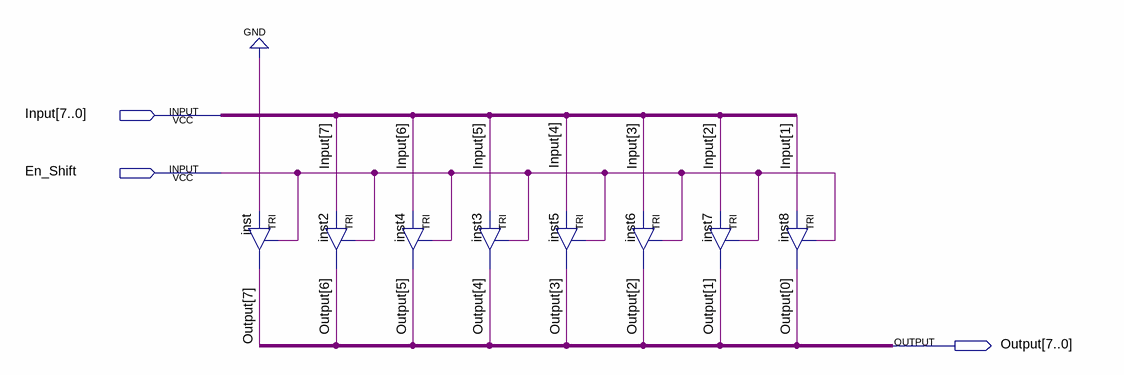
[diagram p0: schematic sheet]
// Quartus schematic Shift_1.bdf as structural Verilog: 8 symbols, 3 pins
module Shift_1 (
  input  [7:0] Input,
  input  En_Shift,
  output [7:0] Output
);

  TRI inst (.IN(1'b0), .OE(En_Shift), .OUT(Output[7]));
  TRI inst2 (.IN(Input[7]), .OE(En_Shift), .OUT(Output[6]));
  TRI inst4 (.IN(Input[6]), .OE(En_Shift), .OUT(Output[5]));
  TRI inst3 (.IN(Input[5]), .OE(En_Shift), .OUT(Output[4]));
  TRI inst5 (.IN(Input[4]), .OE(En_Shift), .OUT(Output[3]));
  TRI inst6 (.IN(Input[3]), .OE(En_Shift), .OUT(Output[2]));
  TRI inst7 (.IN(Input[2]), .OE(En_Shift), .OUT(Output[1]));
  TRI inst8 (.IN(Input[1]), .OE(En_Shift), .OUT(Output[0]));
endmodule
